# Altium project nrf52832_qfaa.PrjPCB
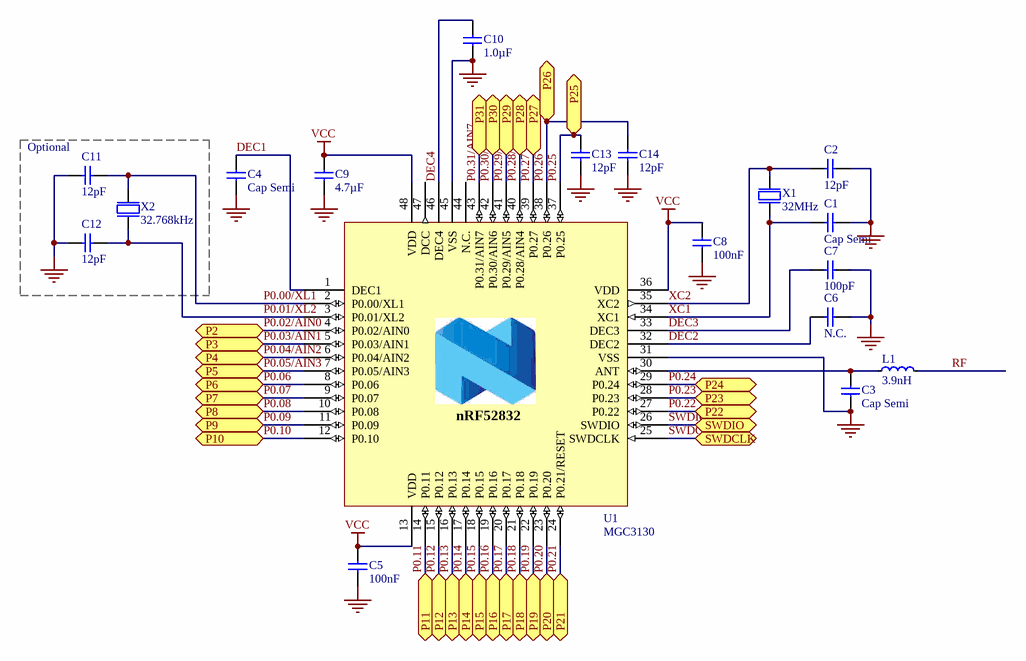
[diagram p0: nrf52832_qfaa.SchDoc]
1 sheet, 18 parts. Net scope: flat (ports and power ports of the same name join across sheets).
Board file: nrf52832_qfax.PcbDoc

## Sheet nrf52832_qfaa.SchDoc: nRF52832-QFAA Reference Layout
size A4; Revision: 1.1; SheetNumber: 1; SheetTotal: 1; DrawnBy: RUBR/KJP; DocumentSize: A4; PCAName: nRF52832-QFAA Reference Layout

### Parts
C1  Cap Semi  [CAPC1005X04L]
C2  12pF  [CAPC1005X04L]
C3  Cap Semi  [CAPC1005X04L]
C4  Cap Semi  [INDC1005X04L]
C5  100nF  [CAPC1005X04L]
C6  N.C.  [CAPC1005X04L]
C7  100pF  [CAPC1005X04L]
C8  100nF  [CAPC1005X04L]
C9  4.7µF  [CAPC1608X06L]
C10  1.0µF  [CAPC1608X06L]
C11  12pF  [CAPC1005X04L]
C12  12pF  [CAPC1005X04L]
C13  12pF  [CAPC1005X04L]
C14  12pF  [CAPC1005X04L]
L1  3.9nH  [INDC1005X04L]
U1  MGC3130  [QFN40P600X600X90-48N]
X1  32MHz  [BT-XTAL_2016]
X2  32.768kHz  [XTAL_3215]

### Blocks framed on the sheet
Optional: C11 C12 X2

### Ports
P2, P3, P4, P5, P6, P7, P8, P9, P10, P11, P12, P13, P14, P15, P16, P17, P18, P19, P20, P21, P22, P23, P24, P25, P26, P27, P28, P29, P30, P31, SWDCLK, SWDIO

### Nets
GND: C1.2 C2.2 C3.1 C4.2 C5.2 C6.1 C7.2 C8.2 C9.2 C10.1 C11.2 C12.2 C13.2 C14.2 U1.31(VSS) U1.45(VSS) U1.49(GND) X1.2(GND) X1.4(GND)
VCC: C5.1 C8.1 C9.1 U1.13(VDD) U1.36(VDD) U1.48(VDD)
DEC1: C4.1 U1.1(DEC1)
DEC2: C6.2 U1.32(DEC2)
DEC3: C7.1 U1.33(DEC3)
DEC4: C10.2 U1.46(DEC4)
P0.00/XL1: C11.1 U1.2(P0.00/XL1) X2.1(inp)
P0.01/XL2: C12.1 U1.3(P0.01/XL2) X2.2(out)
P0.02/AIN0: U1.4(P0.02/AIN0) ; port P2
P0.03/AIN1: U1.5(P0.03/AIN1) ; port P3
P0.04/AIN2: U1.6(P0.04/AIN2) ; port P4
P0.05/AIN3: U1.7(P0.05/AIN3) ; port P5
P0.06: U1.8(P0.06) ; port P6
P0.07: U1.9(P0.07) ; port P7
P0.08: U1.10(P0.08) ; port P8
P0.09: U1.11(P0.09) ; port P9
P0.10: U1.12(P0.10) ; port P10
P0.11: U1.14(P0.11) ; port P11
P0.12: U1.15(P0.12) ; port P12
P0.13: U1.16(P0.13) ; port P13
P0.14: U1.17(P0.14) ; port P14
P0.15: U1.18(P0.15) ; port P15
P0.16: U1.19(P0.16) ; port P16
P0.17: U1.20(P0.17) ; port P17
P0.18: U1.21(P0.18) ; port P18
P0.19: U1.22(P0.19) ; port P19
P0.20: U1.23(P0.20) ; port P20
P0.21: U1.24(P0.21/RESET) ; port P21
P0.22: U1.27(P0.22) ; port P22
P0.23: U1.28(P0.23) ; port P23
P0.24: U1.29(P0.24) ; port P24
P0.25: C13.1 U1.37(P0.25) ; port P25
P0.26: C14.1 U1.38(P0.26) ; port P26
P0.27: U1.39(P0.27) ; port P27
P0.28/AIN4: U1.40(P0.28/AIN4) ; port P28
P0.29/AIN5: U1.41(P0.29/AIN5) ; port P29
P0.30/AIN6: U1.42(P0.30/AIN6) ; port P30
P0.31/AIN7: U1.43(P0.31/AIN7) ; port P31
RF: L1.2
SWDCLK: U1.25(SWDCLK) ; port SWDCLK
SWDIO: U1.26(SWDIO) ; port SWDIO
XC1: C1.1 U1.34(XC1) X1.1(inp)
XC2: C2.1 U1.35(XC2) X1.3(out)
NetC3_2: C3.2 L1.1 U1.30(ANT)

Not connected (* = marked no-connect by the designer): U1 44(N.C.) 47(DCC)

### Notes on the sheet
- Title
- Size
- Date:
- Project Number
- Sheet         of
- Revision
- File:
- Drawn By:
- (in symbol nRF52832-QFAA) nRF52832

### Library data of the parts
C1 = C0402-12p: Capacitor, NP0, ±2%; Value: 12pF; Note: 50V; Artikkelnr Noca: 20029159; Artikkelnr Simpro: N.A.; Part Number: C0402-12p; Manufacturer: *; Manufacturer Part Number: *; Datasheet: *; LatestRevisionDate: 2011-05-11; Pin Count: 2; Publisher: Nordic Semiconductor; Published: 2009-05-08; Supplier: *; Supplier part number: *; 2nd source Supplier: *; 2nd source part number: *; Footprint Doc: 0402
C2 C11-C14 = C0402-12p: Capacitor, NP0, ±2%; Note: 50V; Artikkelnr Noca: 20029159; Artikkelnr Simpro: N.A.; Part Number: C0402-12p; Manufacturer: *; Manufacturer Part Number: *; Datasheet: *; LatestRevisionDate: 2011-05-11; Pin Count: 2; Publisher: Nordic Semiconductor; Published: 2009-05-08; Value: 12pF; Supplier: *; Supplier part number: *; 2nd source Supplier: *; 2nd source part number: *; Footprint Doc: 0402
C3 = C0402-0.8p: Capacitor, NP0, ±5%; Value: 0.8pF; Note: 50V; Artikkelnr Noca: 20029147; Artikkelnr Simpro: N.A.; Part Number: C0402-0.8p; Manufacturer: *; Manufacturer Part Number: *; Datasheet: *; LatestRevisionDate: 2012-11-21; Pin Count: 2; Publisher: Nordic Semiconductor; Published: 2009-05-08; Supplier: *; Supplier part number: *; 2nd source Supplier: *; 2nd source part number: *; Footprint Doc: 0402
C4 = C0402-100n: Capacitor, X7R, ±10%; Value: 100nF; Note: 16V; Artikkelnr Noca: 20039200; Artikkelnr Simpro: N.A.; Part Number: C0402-100n; Manufacturer: *; Manufacturer Part Number: *; Datasheet: *; LatestRevisionDate: 2009-11-23; Pin Count: 2; Publisher: Nordic Semiconductor; Published: 2009-05-08; Supplier: *; Supplier part number: *; 2nd source Supplier: *; 2nd source part number: *; Footprint Doc: 0402
C5 C8 = C0402-100n: Capacitor, X7R, ±10%; Note: 16V; Artikkelnr Noca: 20039200; Artikkelnr Simpro: N.A.; Part Number: C0402-100n; Manufacturer: *; Manufacturer Part Number: *; Datasheet: *; LatestRevisionDate: 2009-11-23; Pin Count: 2; Publisher: Nordic Semiconductor; Published: 2009-05-08; Value: 100nF; Supplier: *; Supplier part number: *; 2nd source Supplier: *; 2nd source part number: *; Footprint Doc: 0402
C6 = C0402-N.C.: Not mounted; Note: Chip Cap; Artikkelnr Noca: N.A.; Part Number: C0402-N.C.; Manufacturer: *; Manufacturer Part Number: *; Datasheet: *; LatestRevisionDate: 2009-05-08; Pin Count: 2; Publisher: Nordic Semiconductor; Published: 2009-05-08; Value: N.C.; Supplier: *; Supplier part number: *; 2nd source Supplier: *; 2nd source part number: *; Footprint Doc: 0402; Artikkelnr Simpro: N.A.
C7 = C0402-100p: Capacitor, NP0, ±5%; Note: 50V; Artikkelnr Noca: 20029135; Artikkelnr Simpro: N.A.; Part Number: C0402-100p; Manufacturer: *; Manufacturer Part Number: *; Datasheet: *; LatestRevisionDate: 2009-05-08; Pin Count: 2; Publisher: Nordic Semiconductor; Published: 2009-05-08; Value: 100pF; Supplier: *; Supplier part number: *; 2nd source Supplier: *; 2nd source part number: *; Footprint Doc: 0402
C9 = C0603-4µ7: Capacitor, X5R, ±10%; Note: 6.3V; Artikkelnr Noca: 20069060; Artikkelnr Simpro: N.A.; Part Number: C0603-4µ7; Manufacturer: *; Manufacturer Part Number: *; Datasheet: *; LatestRevisionDate: 2009-11-23; Pin Count: 2; Publisher: Nordic Semiconductor; Published: 2009-05-08; Value: 4.7µF; Supplier: *; Supplier part number: *; 2nd source Supplier: *; 2nd source part number: *; Footprint Doc: 0603
C10 = C0603-1µ0: Capacitor, X7R, ±10%; Note: 16V; Artikkelnr Noca: 20039335; Artikkelnr Simpro: N.A.; Part Number: C0603-1µ0; Manufacturer: *; Manufacturer Part Number: *; Datasheet: *; LatestRevisionDate: 2013-06-05; Pin Count: 2; Publisher: Nordic Semiconductor; Published: 2009-05-08; Value: 1.0µF; Supplier: *; Supplier part number: *; 2nd source Supplier: *; 2nd source part number: *; Footprint Doc: 0603
L1 = L0402-3n9: High frequency chip inductor ±5%; Manufacturer: Murata; Manufacturer Part Number: LQP15MN3N9B02D; Artikkelnr Noca: 33029151; Artikkelnr Simpro: N.A.; Part Number: L0402-3n9; Datasheet: http://search.murata.co.jp/Ceramy/image/img/PDF/ENG/L0075S0084LQP15M.pdf; LatestRevisionDate: 2012-09-19; Pin Count: 2; Publisher: Nordic Semiconductor; Published: 2009-05-08; Value: 3.9nH; Note: High frequency chip inductor ±5%; Supplier: Digi-Key; Supplier part number: 490-1131-1-ND; 2nd source Supplier: *; 2nd source part number: *; Footprint Doc: 0402
U1 = nRF52832-QFAA: Multi-protocol Bluetooth Low Energy, ANT and 2.4GHz proprietary system-on-chip; Manufacturer: Nordic Semiconductor; Artikkelnr Noca: N.A.; Part Number: nRF52832-QFAA; Manufacturer Part Number: nRF52832-QFAA; Datasheet: *; LatestRevisionDate: 2014-11-26; Pin Count: 48; Publisher: Nordic Semiconductor; Published: 2014-11-26; Value: nRF52832-QFAA; Note: *; Supplier: Nordic Semiconductor; Supplier part number: *; 2nd source Supplier: *; 2nd source part number: *; Footprint Doc: QFN-48; Artikkelnr Simpro: N.A.
X1 = XTAL_SMD2016_32MHz_8pF_General: XTAL SMD 2016, 32MHz, Cl=8pF, Total Tol: ±40ppm; Note: XTAL SMD 32.000MHz; Artikkelnr Noca: N.A.; Part Number: XTAL_SMD2016_32MHz_8pF_General; Manufacturer: *; Manufacturer Part Number: *; Datasheet: *; LatestRevisionDate: 2016-08-19; Pin Count: 4; Publisher: Nordic Semiconductor; Published: 2016-08-19; Value: 32MHz; Supplier: *; Supplier part number: *; 2nd source Supplier: *; 2nd source part number: *; Footprint Doc: XTAL_2016; Artikkelnr Simpro: N.A.
X2 = XTAL_SMD3215_32.768kHz_9pF_General: XTAL SMD 3215, 32.768kHz, Cl=9pF, Total Tol: ±50ppm; Note: XTAL SMD 32.768kHz; Artikkelnr Noca: N.A.; Part Number: XTAL_SMD3215_32.768kHz_9pF_General; Manufacturer: *; Manufacturer Part Number: *; Datasheet: *; LatestRevisionDate: 2016-08-19; Pin Count: 2; Publisher: Nordic Semiconductor; Published: 2016-08-19; Value: 32.768kHz; Supplier: *; Supplier part number: *; 2nd source Supplier: *; 2nd source part number: *; Footprint Doc: XTAL_3215; Artikkelnr Simpro: N.A.